# Altium schematic sheet Input and Output Sensors.SchDoc
size A
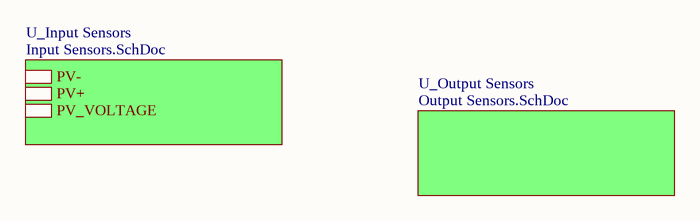
[diagram p0: Input and Output Sensors.SchDoc]

## Sub-sheets
U_Input Sensors = Input Sensors.SchDoc: PV-, PV+, PV_VOLTAGE
U_Output Sensors = Output Sensors.SchDoc: no entries